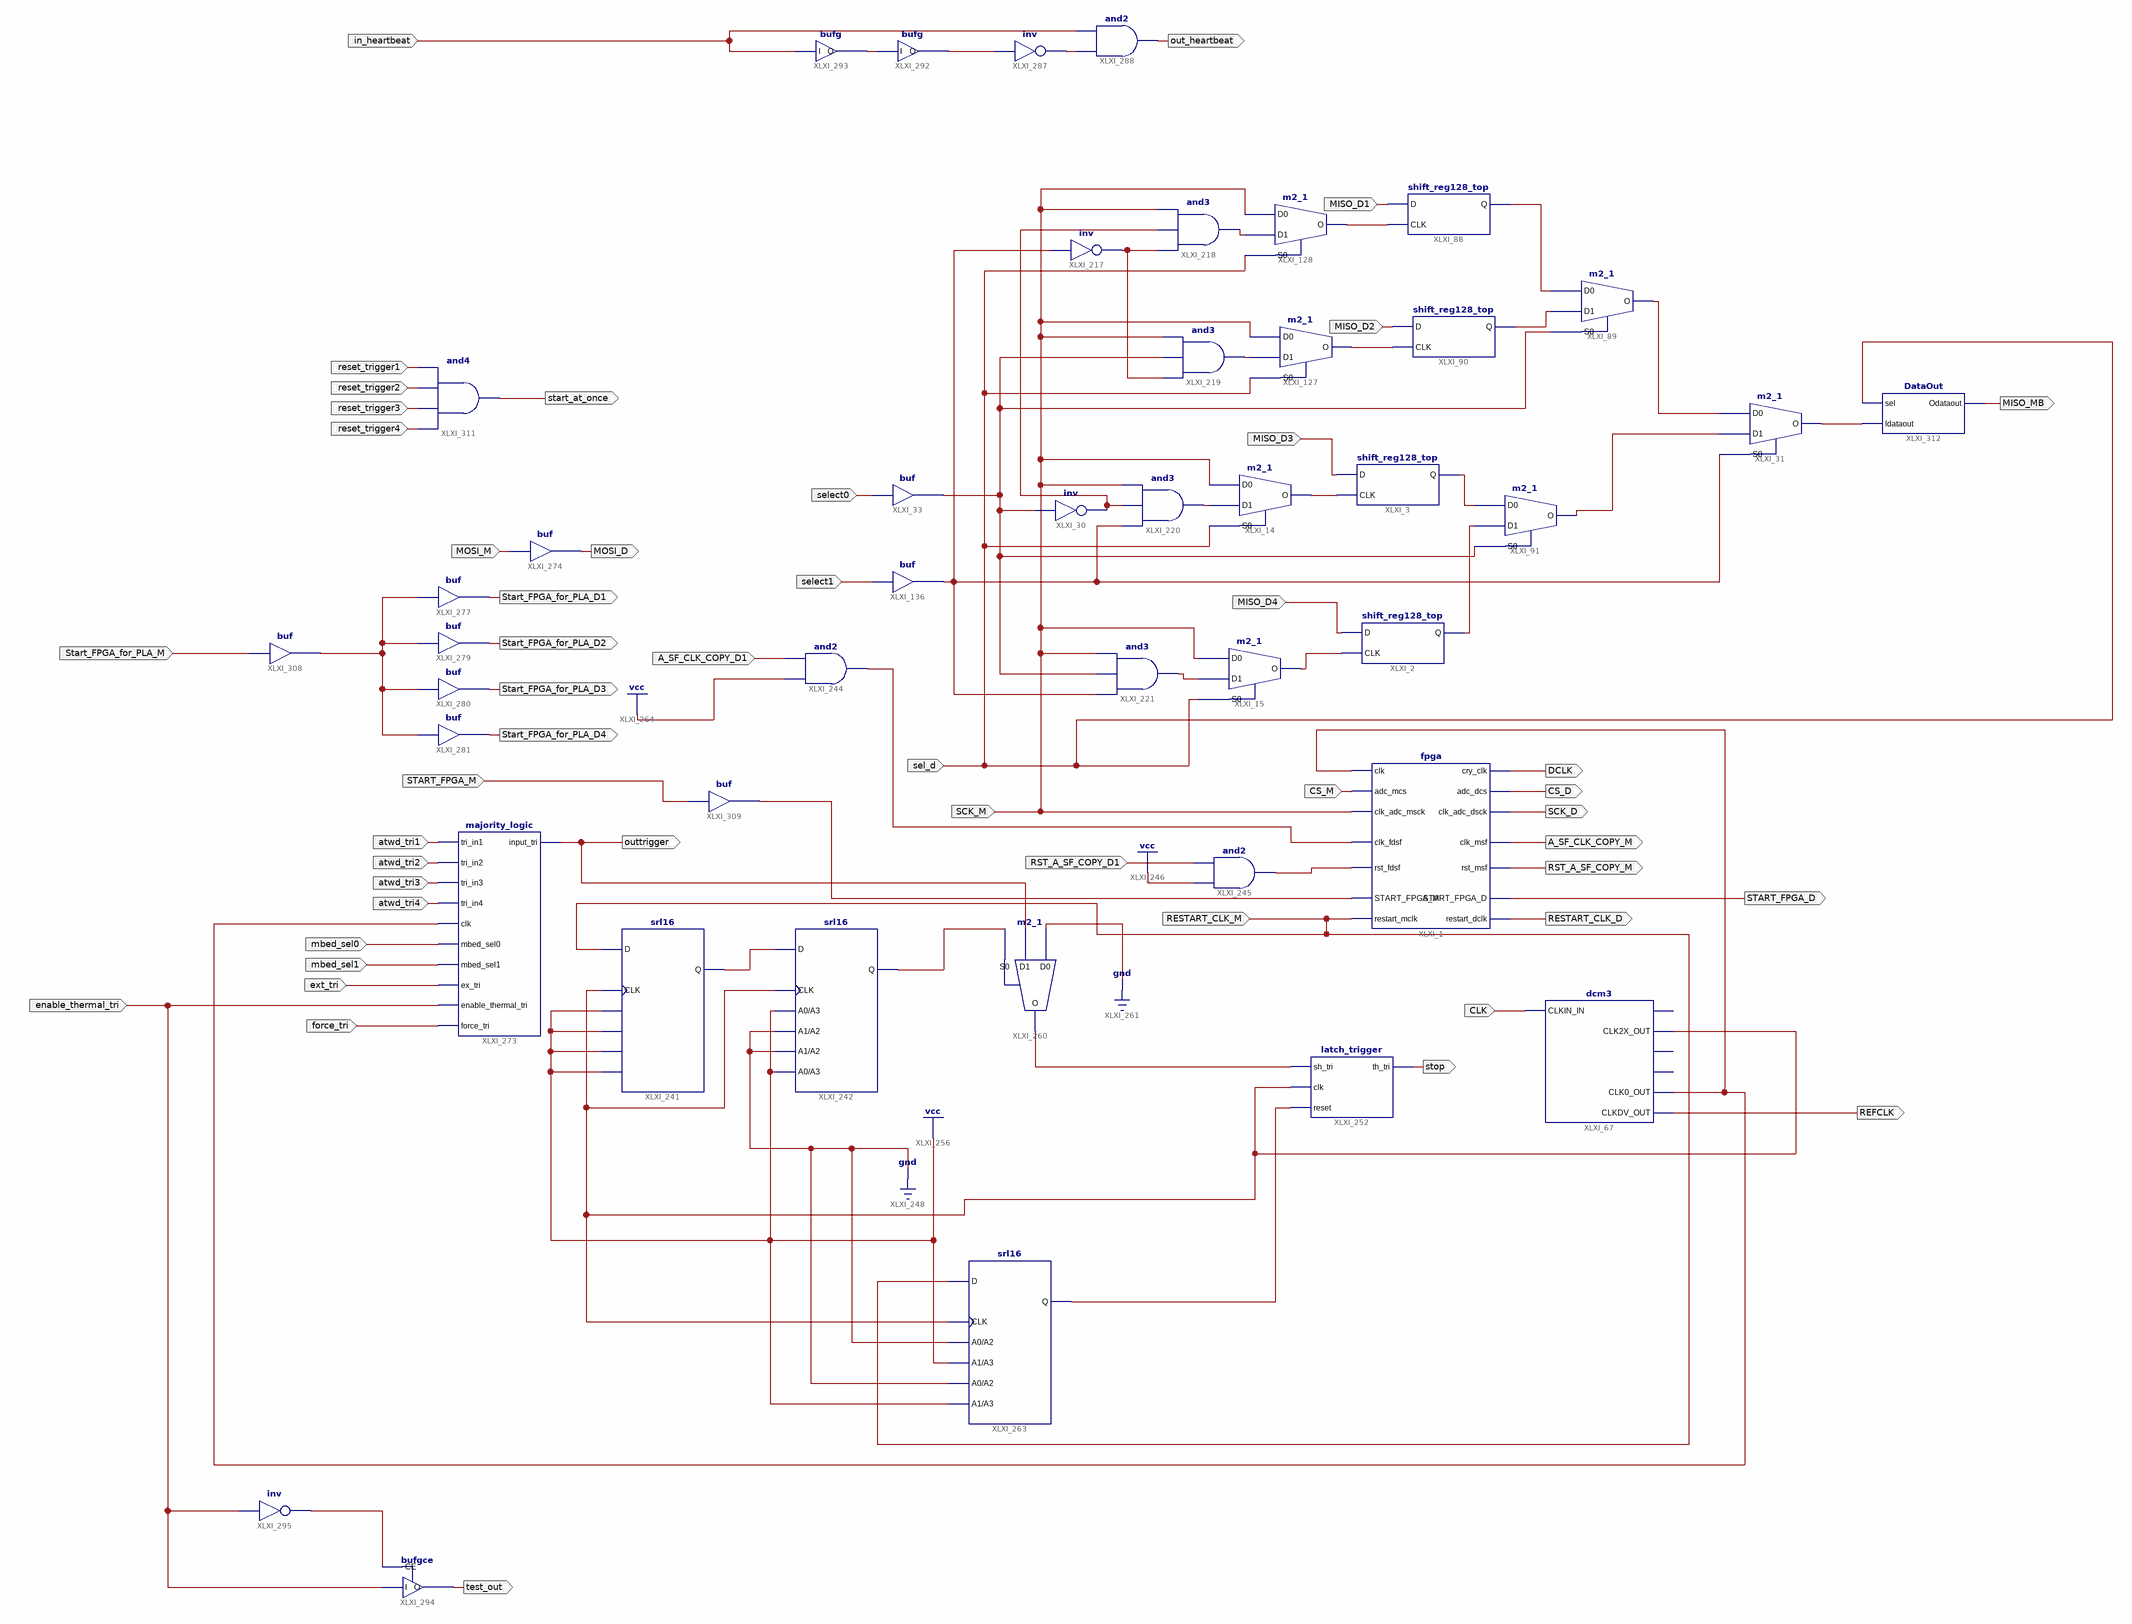
[diagram p0: schematic sheet 1]
// Xilinx ISE schematic TOP (2).sch (spartan3a) as structural Verilog: 44 symbols, 49 ports
module \TOP_(2)  (
  input  select0,
  input  select1,
  input  CLK,
  input  START_FPGA_M,
  input  CS_M,
  input  sel_d,
  input  SCK_M,
  input  A_SF_CLK_COPY_D1,
  input  RST_A_SF_COPY_D1,
  input  RESTART_CLK_M,
  input  MISO_D1,
  input  MISO_D2,
  input  ext_tri,
  input  mbed_sel0,
  input  mbed_sel1,
  input  MOSI_M,
  input  enable_thermal_tri,
  input  force_tri,
  input  MISO_D3,
  input  MISO_D4,
  input  in_heartbeat,
  input  Start_FPGA_for_PLA_M,
  input  atwd_tri1,
  input  reset_trigger1,
  input  atwd_tri2,
  input  reset_trigger2,
  input  reset_trigger3,
  input  reset_trigger4,
  input  atwd_tri3,
  input  atwd_tri4,
  output RST_A_SF_COPY_M,
  output SCK_D,
  output RESTART_CLK_D,
  output START_FPGA_D,
  output A_SF_CLK_COPY_M,
  output CS_D,
  output DCLK,
  output stop,
  output outtrigger,
  output MOSI_D,
  output start_at_once,
  output Start_FPGA_for_PLA_D1,
  output Start_FPGA_for_PLA_D2,
  output Start_FPGA_for_PLA_D3,
  output Start_FPGA_for_PLA_D4,
  output REFCLK,
  output out_heartbeat,
  output test_out,
  output MISO_MB
);

  wire MISO_M, XLXN_134, XLXN_163, XLXN_164, XLXN_175, XLXN_363, XLXN_365, XLXN_366, XLXN_367, XLXN_378,
       XLXN_379, XLXN_480, XLXN_481, XLXN_501, XLXN_503, XLXN_517, XLXN_519, XLXN_854, XLXN_855, XLXN_892,
       XLXN_893, XLXN_901, XLXN_925, XLXN_930, XLXN_946, XLXN_952, XLXN_967, XLXN_968, XLXN_969, XLXN_979,
       XLXN_983, XLXN_1025, XLXN_1033;

  shift_reg128_top XLXI_88 (.D(MISO_D1), .CLK(XLXN_365), .Q(XLXN_366));
  m2_1 XLXI_89 (.D0(XLXN_366), .D1(XLXN_367), .S0(XLXN_503), .O(XLXN_517));
  m2_1 XLXI_127 (.D0(SCK_M), .D1(XLXN_480), .S0(sel_d), .O(XLXN_363));
  buf XLXI_33 (XLXN_503, select0);
  shift_reg128_top XLXI_90 (.D(MISO_D2), .CLK(XLXN_363), .Q(XLXN_367));
  shift_reg128_top XLXI_3 (.D(MISO_D3), .CLK(XLXN_134), .Q(XLXN_379));
  m2_1 XLXI_91 (.D0(XLXN_379), .D1(XLXN_378), .S0(XLXN_503), .O(XLXN_519));
  buf XLXI_136 (XLXN_855, select1);
  dcm3 XLXI_67 (
    .CLKIN_IN(CLK), .CLK2X_OUT(XLXN_946), .CLK0_OUT(XLXN_930), .CLKDV_OUT(REFCLK));  // open: LOCKED_OUT, CLKFX_OUT, CLKIN_IBUFG_OUT
  fpga XLXI_1 (
    .START_FPGA_M(XLXN_1025), .restart_mclk(RESTART_CLK_M), .START_FPGA_D(START_FPGA_D),
    .restart_dclk(RESTART_CLK_D), .clk(XLXN_930), .adc_mcs(CS_M), .clk_adc_msck(SCK_M), .cry_clk(DCLK),
    .adc_dcs(CS_D), .clk_adc_dsck(SCK_D), .clk_msf(A_SF_CLK_COPY_M), .clk_fdsf(XLXN_892),
    .rst_fdsf(XLXN_893), .rst_msf(RST_A_SF_COPY_M));
  shift_reg128_top XLXI_2 (.D(MISO_D4), .CLK(XLXN_175), .Q(XLXN_378));
  and XLXI_218 (XLXN_481, XLXN_854, XLXN_501, SCK_M);
  and XLXI_219 (XLXN_480, XLXN_854, XLXN_503, SCK_M);
  and XLXI_220 (XLXN_163, XLXN_855, XLXN_501, SCK_M);
  not XLXI_30 (XLXN_501, XLXN_503);
  and XLXI_221 (XLXN_164, XLXN_855, XLXN_503, SCK_M);
  m2_1 XLXI_31 (.D0(XLXN_517), .D1(XLXN_519), .S0(XLXN_855), .O(MISO_M));
  not XLXI_217 (XLXN_854, XLXN_855);
  and XLXI_245 (XLXN_893, 1'b1, RST_A_SF_COPY_D1);
  srl16 XLXI_241 (.A0(1'b1), .A1(1'b1), .A2(1'b1), .A3(1'b1), .CLK(XLXN_946), .D(RESTART_CLK_M), .Q(XLXN_901));
  srl16 XLXI_242 (.A0(1'b1), .A1(1'b0), .A2(1'b0), .A3(1'b1), .CLK(XLXN_946), .D(XLXN_901), .Q(XLXN_952));
  latch_trigger XLXI_252 (.sh_tri(XLXN_925), .clk(XLXN_946), .reset(XLXN_967), .th_tri(stop));
  m2_1 XLXI_15 (.D0(SCK_M), .D1(XLXN_164), .S0(sel_d), .O(XLXN_175));
  m2_1 XLXI_14 (.D0(SCK_M), .D1(XLXN_163), .S0(sel_d), .O(XLXN_134));
  m2_1 XLXI_260 (.D0(1'b0), .D1(outtrigger), .S0(XLXN_952), .O(XLXN_925));
  srl16 XLXI_263 (.A0(1'b0), .A1(1'b1), .A2(1'b0), .A3(1'b1), .CLK(XLXN_946), .D(RESTART_CLK_M), .Q(XLXN_967));
  and XLXI_244 (XLXN_892, 1'b1, A_SF_CLK_COPY_D1);
  m2_1 XLXI_128 (.D0(SCK_M), .D1(XLXN_481), .S0(sel_d), .O(XLXN_365));
  majority_logic XLXI_273 (
    .tri_in1(atwd_tri1), .tri_in2(atwd_tri2), .tri_in3(atwd_tri3), .tri_in4(atwd_tri4), .clk(XLXN_930),
    .mbed_sel0(mbed_sel0), .mbed_sel1(mbed_sel1), .enable_thermal_tri(enable_thermal_tri), .ex_tri(ext_tri),
    .force_tri(force_tri), .input_tri(outtrigger));
  buf XLXI_274 (MOSI_D, MOSI_M);
  buf XLXI_277 (Start_FPGA_for_PLA_D1, XLXN_1033);
  buf XLXI_279 (Start_FPGA_for_PLA_D2, XLXN_1033);
  buf XLXI_280 (Start_FPGA_for_PLA_D3, XLXN_1033);
  buf XLXI_281 (Start_FPGA_for_PLA_D4, XLXN_1033);
  not XLXI_287 (XLXN_969, XLXN_968);
  and XLXI_288 (out_heartbeat, XLXN_969, in_heartbeat);
  bufg XLXI_292 (.I(XLXN_979), .O(XLXN_968));
  bufg XLXI_293 (.I(in_heartbeat), .O(XLXN_979));
  bufgce XLXI_294 (.CE(XLXN_983), .I(enable_thermal_tri), .O(test_out));
  not XLXI_295 (XLXN_983, enable_thermal_tri);
  buf XLXI_308 (XLXN_1033, Start_FPGA_for_PLA_M);
  buf XLXI_309 (XLXN_1025, START_FPGA_M);
  and XLXI_311 (start_at_once, reset_trigger4, reset_trigger3, reset_trigger2, reset_trigger1);
  DataOut XLXI_312 (.sel(sel_d), .Idataout(MISO_M), .Odataout(MISO_MB));
endmodule
